# Altium schematic sheet QUTMS-TSAL2-S00.SchDoc: Tractive System Active Light - TSAL
size A3; DrawnBy: Joseph Richards; DocumentNumber: 1; Revision: 2; SheetNumber: 1; SheetTotal: 3
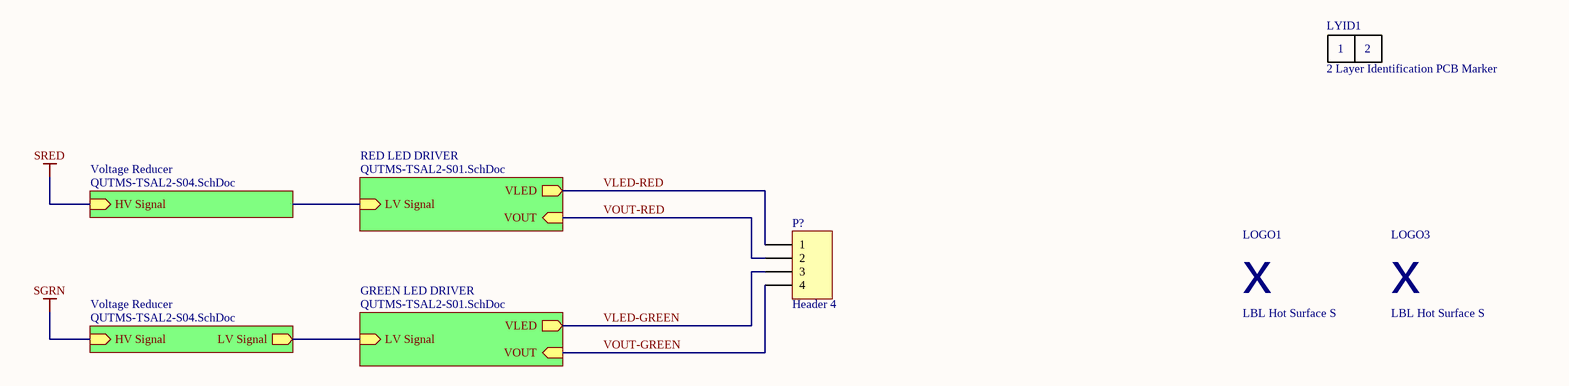
[diagram p0: QUTMS-TSAL2-S00.SchDoc]

## Parts
LOGO1  LBL Hot Surface S  [LBL HOT SMALL]
LOGO3  LBL Hot Surface S  [LBL HOT SMALL]
LYID1  2 Layer Identification PCB Marker  [LAYER IDENT 2]
P?  Header 4  [HDR1X4]

## Sub-sheets
GREEN LED DRIVER = QUTMS-TSAL2-S01.SchDoc: VLED (out), VOUT (in), LV Signal (in)
RED LED DRIVER = QUTMS-TSAL2-S01.SchDoc: VLED (out), VOUT (in), LV Signal (in)
Voltage Reducer = QUTMS-TSAL2-S04.SchDoc: HV Signal (in)
Voltage Reducer = QUTMS-TSAL2-S04.SchDoc: HV Signal (in), LV Signal (out)

## Nets
SGRN: sheet Voltage Reducer/HV Signal
SRED: sheet Voltage Reducer/HV Signal
VLED-GREEN: P?.3 ; sheet GREEN LED DRIVER/VLED
VLED-RED: P?.1 ; sheet RED LED DRIVER/VLED
VOUT-GREEN: P?.4 ; sheet GREEN LED DRIVER/VOUT
VOUT-RED: P?.2 ; sheet RED LED DRIVER/VOUT
(unnamed): sheet GREEN LED DRIVER/LV Signal, sheet Voltage Reducer/LV Signal

## Notes on the sheet
- Revision History:
- Sheet Title:
- Rev
- Date
- Description
- Project:
- Size:
- Drawn By:
- A3
- Number:
- Revision:
- Sheet
- Version:
- of
- QUT Motorsport
- O-120, Gardens Point
- 2 George Street
- Brisbane, QLD 4000
- Australia
- Print Date:
- Print Time:
- File Name:
- (in symbol Layer Identification 2) 1; 2
- (in symbol LBL Hot Surface S) x

## Library data of the parts
LYID1 = Layer Identification 2
P? = Header 4: Header, 4-Pin; LatestRevisionDate: 17-Jul-2002; LatestRevisionNote: Re-released for DXP Platform.; Publisher: Altium Limited